# EAGLE design conductivity (EAGLE 9.2.2)
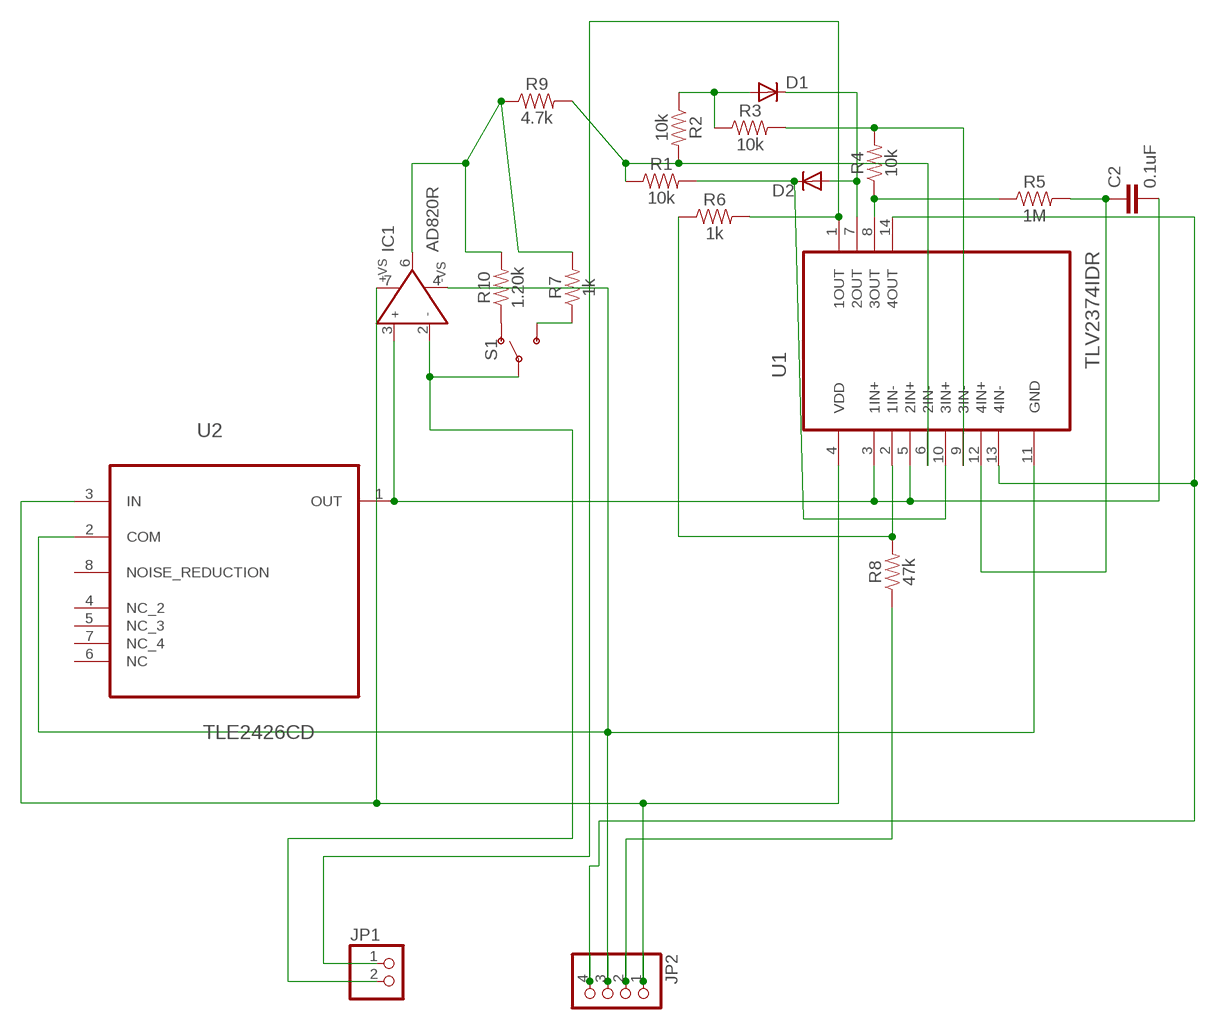
[diagram p0: schematic, sheet 1]

## Parts
C2  0.1uF  0.1UF-0603-25V-5%  [0603]
D1  DIODESOD123  [SOD123]
D2  DIODESOD123  [SOD123]
IC1  AD820R  [SO8]
JP1  PINHD-1X2  [1X02]
JP2  PINHD-1X4  [1X04]
R1  10k  10KOHM-0603-1/10W-1%  [0603]
R2  10k  10KOHM-0603-1/10W-1%  [0603]
R3  10k  10KOHM-0603-1/10W-1%  [0603]
R4  10k  10KOHM-0603-1/10W-1%  [0603]
R5  1M  1MOHM-0603-1/4W-5%  [0603]
R6  1k  1KOHM-0603-1/10W-1%  [0603]
R7  1k  1KOHM-0603-1/10W-1%  [0603]
R8  47k  47KOHM-0603-1/10W-1%  [0603]
R9  4.7k  4.7KOHM-0603-1/10W-1%  [0603]
R10  1.20k  1.20KOHM-0603-1/10W-1%  [0603]
S1  SWITCH-SPDT-SMD-AYZ0202  [SWITCH_DPDT_SMD_AYZ0202]
U1  TLV2374IDR  [SOIC127P600X175-14N]
U2  TLE2426CD  [SOIC127P600X175-8N]

## Nets
FROMWATER: IC1.2(IN-) JP1.2 S1.2(P)
N$1: IC1.7(+VS) JP2.1 U1.4(VDD) U2.3(IN)
N$2: R10.1 S1.1(O)
N$3: C2.2 IC1.3(IN+) U1.3(1IN+) U1.5(2IN+) U2.1(OUT)
N$4: R6.1 R8.2 U1.2(1IN-)
N$5: IC1.6(OUT) R7.2 R9.1 R10.2
N$6: R1.1 R2.2 R9.2 U1.6(2IN-)
N$7: D1.ANODE(A) R2.1 R3.1
N$8: D1.CATHODE(C) D2.ANODE(A) U1.7(2OUT)
N$9: D2.CATHODE(C) R1.2 U1.10(3IN+)
N$10: R3.2 R4.2 U1.9(3IN-)
N$11: R4.1 R5.1 U1.8(3OUT)
N$12: C2.1 R5.2 U1.12(4IN+)
N$13: JP2.4 U1.13(4IN-) U1.14(4OUT)
N$14: JP2.2 R8.1
N$15: IC1.4(-VS) JP2.3 U1.11(GND) U2.2(COM)
N$16: JP1.1 R6.2 U1.1(1OUT)
N$17: R7.1 S1.3(S)
Unconnected: U2.4(NC_2) U2.5(NC_3) U2.6(NC) U2.7(NC_4) U2.8(NOISE_REDUCTION)

## Library data of the parts
C2 = SparkFun-Capacitors:0.1UF: 0.1µF ceramic capacitors A capacitor is a passive two-terminal electrical component used to store electrical energy temporarily in an electric field.; PROD_ID: CAP-08604
D1 D2 = trellisLaura:DIODE: DIODE high speed (Philips)
IC1 = AD820:AD820: Single-Supply, Rail-to-Rail, Low Power, FET Input Op Amp Source: http://www.analog.com/static/imported-files/data_sheets/AD820.pdf; AVAILABILITY: Unavailable; MF: Analog Devices; MP: AD820; PACKAGE: None; PRICE: None
JP1 = pinhead:PINHD-1X2: PIN HEADER
JP2 = pinhead:PINHD-1X4: PIN HEADER
R1-R4 = SparkFun-Resistors:10KOHM: 10kΩ resistor A resistor is a passive two-terminal electrical component that implements electrical resistance as a circuit element. Resistors act to reduce current flow, and, at the same time, act to lower voltage levels within circuits. - Wikipedia; PROD_ID: RES-00824
R5 = SparkFun-Resistors:1MOHM: 1MΩ resistor A resistor is a passive two-terminal electrical component that implements electrical resistance as a circuit element. Resistors act to reduce current flow, and, at the same time, act to lower voltage levels within circuits. - Wikipedia; PROD_ID: RES-07868
R6 R7 = SparkFun-Resistors:1KOHM: 1kΩ resistor A resistor is a passive two-terminal electrical component that implements electrical resistance as a circuit element. Resistors act to reduce current flow, and, at the same time, act to lower voltage levels within circuits. - Wikipedia; PROD_ID: RES-07856
R8 = SparkFun-Resistors:47KOHM: 47kΩ resistor A resistor is a passive two-terminal electrical component that implements electrical resistance as a circuit element. Resistors act to reduce current flow, and, at the same time, act to lower voltage levels within circuits. - Wikipedia; PROD_ID: RES-07871
R9 = SparkFun-Resistors:4.7KOHM: 4.7kΩ resistor A resistor is a passive two-terminal electrical component that implements electrical resistance as a circuit element. Resistors act to reduce current flow, and, at the same time, act to lower voltage levels within circuits. - Wikipedia; PROD_ID: RES-07857
R10 = SparkFun-Resistors:1.20KOHM: 1.20kΩ resistor A resistor is a passive two-terminal electrical component that implements electrical resistance as a circuit element. Resistors act to reduce current flow, and, at the same time, act to lower voltage levels within circuits. - Wikipedia; PROD_ID: RES-08413
S1 = SparkFun-Switches:SWITCH-SPDT: Single Pole, Double Throw (SPDT) Switch Single-pole, double-throw (SPDT) switch. Variant Overview SMD-AYZ0202 Surface Mount DPDT Switch <https://www.sparkfun.com/products/597> (COM-00597) Used on e.g. LilyPad Arduino USB - ATmega32U4 Board <https://www.sparkfun.com/products/12049> PTH-11.6X4.0MM SPDT Mini Power Switch <https://www.sparkfun.com/products/102> (COM-00102) Used on e.g. SparkFun Simon Says - Through-Hole Soldering Kit <https://www.sparkfun.com/products/10547> (KIT-10547) PTH-11.6X4.0MM-KIT KIT version of SPDT Mini Power Switch - Simplifies soldering by removing tStop of switch pins - only one side can be soldered. PTH-11.6X4.0MM-LOCK LOCK version of SPDT Mini Power Switch - Offset pins hold switch in place for easier soldering. SMD-RIGHT-ANGLE Surface Mount Right Angle Switch <https://www.sparkfun.com/products/10860> (COM-10860) Used on e.g. SparkFun ESP8266 Thing <https://www.sparkfun.com/products/13231>; PROD_ID: SWCH-08179; SF_ID: COM-00597
U1 = TLV2374IDR:TLV2374IDR: OPERATIONAL AMPLIFIERS; AVAILABILITY: Good; DESCRIPTION: 550-uA/Channel 3-MHz RRIO Op Amp 14-SOIC -40 to 125; MF: Texas Instruments; MP: TLV2374IDR; PACKAGE: SOIC-14 Texas Instruments; PRICE: 1.13 USD
U2 = TLE2426CD:TLE2426CD: PRECISION VIRTUAL GROUND; AVAILABILITY: Good; DESCRIPTION: Voltage Reference Adjustable 2 Volt TO 20 Volt 20 mA 8-Pin SOIC Tube; MF: Texas Instruments; MP: TLE2426CD; PACKAGE: SOIC-8 Texas Instruments; PRICE: 1.16 USD

## Net classes
0 default: width 0.305 mm, drill 0.508 mm, clearance 0.254 mm

## Board
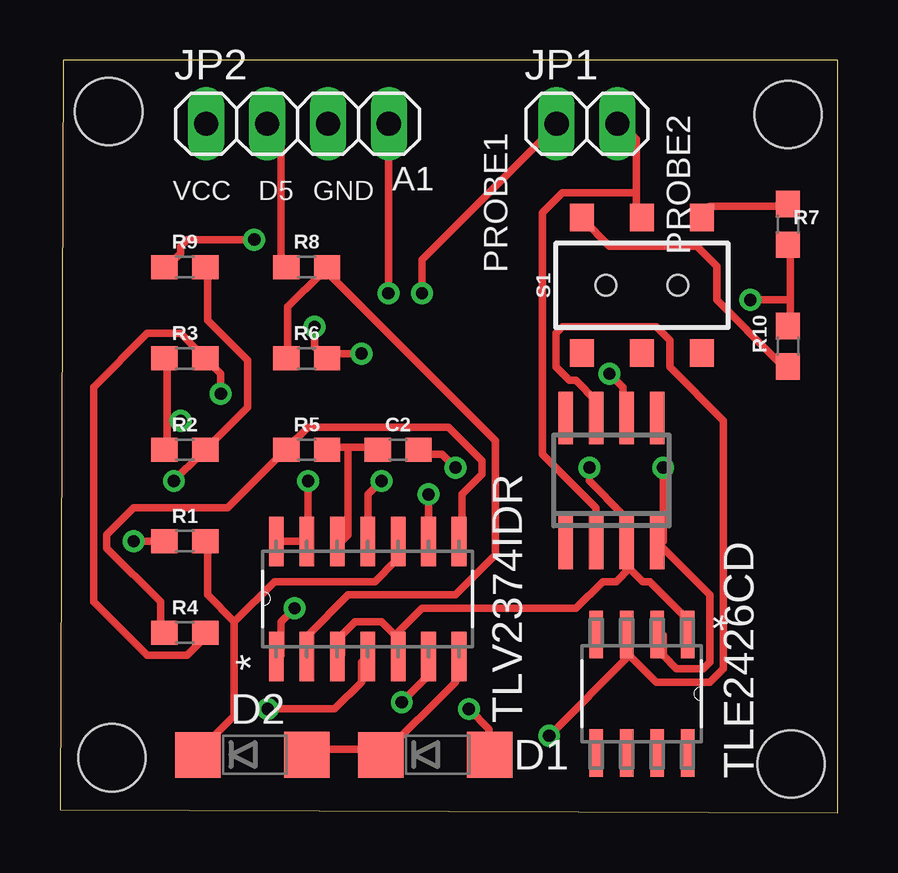
[diagram p1: board, top side]
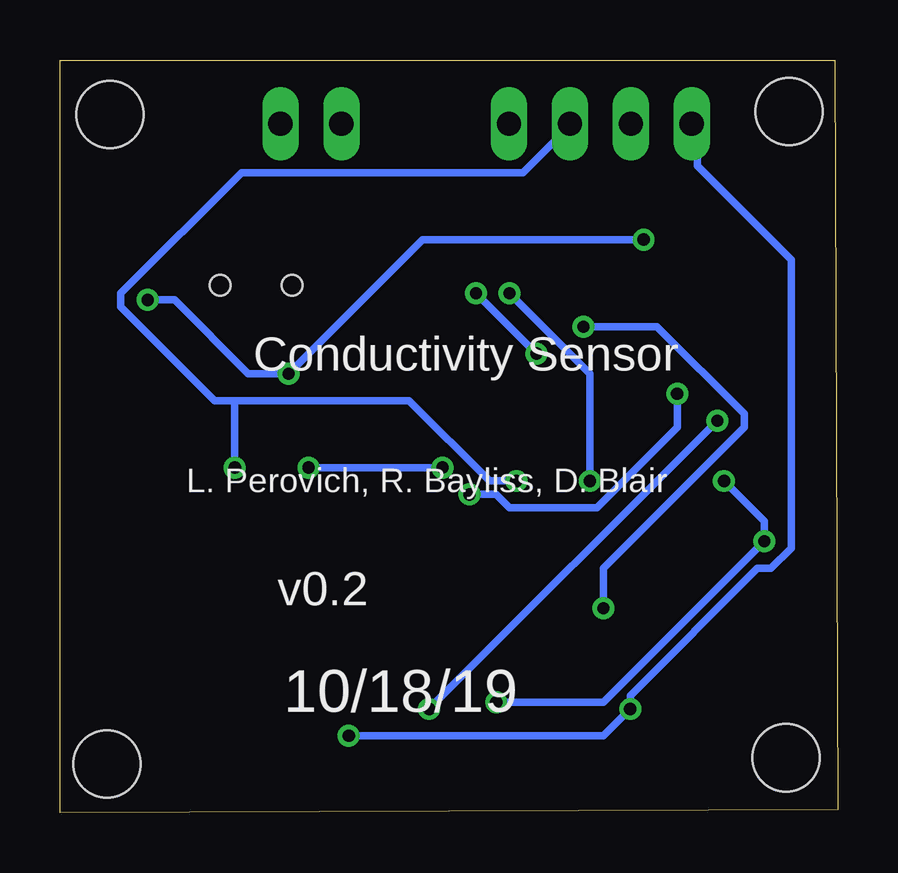
[diagram p2: board, bottom side, seen from below]

Size 32.44 x 31.36 mm. Coordinates in mm from the lower left corner, seen from the top.
Outline: 0,0.13 32.44,0 32.44,31.36 0.13,31.36 0,0.13
Copper layers (1*16): Top 0.035mm / dielectric 1.5mm / Bottom 0.035mm
Design rules "default": minimum track width 6mil, minimum drill 0.35mm, track to track 6mil, track to pad 6mil, pad to pad 6mil, via to via 6mil, smd to smd 6mil, copper to edge 40mil, drill to drill 6mil, minimum pad ring 10mil, minimum via ring 8mil, stop-mask expansion 4mil, vias tented up to drill 0mil, thermal gap 10mil
Holes 2.8 mm at 2.03,29.21 30.35,29.08 30.48,2.03 2.16,2.29

### Footprints (pad centres in the part's own frame; a part is rotated, then mirrored left to right if it is on the bottom)
0603 = smd 1.1 x 1: 1 -0.85,0; 2 0.85,0
SOD123 = smd 1.905 x 1.905: ANODE 2.165,0; CATHODE -2.375,-0.014
SO8 = smd 0.6 x 2.2: 1 -1.905,-2.6; 2 -0.635,-2.6; 3 0.635,-2.6; 4 1.905,-2.6; 5 1.905,2.6; 6 0.635,2.6; 7 -0.635,2.6; 8 -1.905,2.6
1X02 = drill 1.016 long: 1 -1.27,0; 2 1.27,0
1X04 = drill 1.016 long: 1 -3.81,0; 2 -1.27,0; 3 1.27,0; 4 3.81,0
SWITCH_DPDT_SMD_AYZ0202 = smd 1 x 1.15: 1 -2.5,2.825; 2 0,2.825; 3 2.5,2.825; 4 -2.5,-2.825; 5 0,-2.825; 6 2.5,-2.825 | hole 0.85: 1.5,0; -1.5,0
SOIC127P600X175-14N = smd 2.057 x 0.61: 1 -4.801,7.62; 2 -4.801,6.35; 3 -4.801,5.08; 4 -4.801,3.81; 5 -4.801,2.54; 6 -4.801,1.27; 7 -4.801,0; 8 0,0; 9 0,1.27; 10 0,2.54; 11 0,3.81; 12 0,5.08; 13 0,6.35; 14 0,7.62
SOIC127P600X175-8N = smd 1.981 x 0.559: 1 -2.464,1.905; 2 -2.464,0.635; 3 -2.464,-0.635; 4 -2.464,-1.905; 5 2.464,-1.905; 6 2.464,-0.635; 7 2.464,0.635; 8 2.464,1.905

### Placement (x,y rotation side)
C2  14.1,15.11 0 top
D1  15.75,2.41 0 top
D2  8.13,2.41 0 top
IC1  22.99,13.84 0 top
JP1  21.97,28.7 0 top
JP2  9.91,28.7 0 top
R1  5.21,11.3 0 top
R2  5.21,15.11 0 top
R3  5.21,18.92 0 top
R4  5.21,7.49 0 top
R5  10.29,15.11 0 top
R6  10.29,18.92 0 top
R7  30.35,24.51 270 top
R8  10.29,22.73 0 top
R9  5.21,22.73 0 top
R10  30.35,19.43 90 top
S1  24.26,21.97 0 top
U1  16.64,11.3 90 top
U2  24.26,4.95 270 top

### Tracks (layer width: path | path; a pad name or v marks a point on that pad's centre or on a via)
FROMWATER
  Top 0.305: 24.03,25.83 24.03,28.07 23.47,28.63 JP1.2 | 24.03,25.83 24.03,24.99 S1.2 | IC1.2 22.35,12.7 20.12,14.94 20.12,24.99 20.95,25.83 24.03,25.83
N$1  (via drill 0.51)
  Top 0.305: 23.75,6.55 23.75,7.39 U2.3 23.75,6.55 | 23.75,6.55 24.87,5.44 27.1,5.44 27.66,5.99 27.66,16.33 25.43,18.57 25.43,19.68 24.87,20.24 20.95,20.24 20.68,19.96 20.68,18.57 21.23,18.01 21.51,18.01 22.35,17.17 IC1.7 | v8.66,4.32 11.46,4.32 12.57,5.44 12.57,6.27 U1.4 | v20.4,3.2 23.75,6.55
  Bottom 0.305: JP2.1 5.87,28.63 5.87,26.95 1.96,23.04 1.96,11.02 2.79,10.19 3.35,10.19 8.66,4.88 v8.66,4.32 9.78,3.2 v20.4,3.2
N$2
  Top 0.305: R10.1 30.18,18.85 29.9,18.85 27.38,21.36 27.38,22.76 26.54,23.6 22.91,23.6 21.79,24.71 S1.1
N$3  (via drill 0.51)
  Top 0.305: 13.97,7.39 13.41,7.95 12.29,7.95 11.73,7.39 11.73,6.55 U1.3 | 13.97,7.39 13.97,6.55 U1.5 13.97,7.39 | v16.48,14.38 15.93,14.94 15.09,14.94 C2.2 | v22.07,14.38 22.07,13.82 23.47,12.42 23.47,11.3 IC1.3 | 23.75,10.19 24.31,9.63 24.59,9.63 25.98,8.23 25.98,7.67 U2.1 | 23.75,10.19 23.75,11.02 IC1.3 | 13.97,7.39 15.09,8.51 21.51,8.51 22.63,9.63 23.19,9.63 23.75,10.19 | 23.75,10.19 IC1.3
  Bottom 0.305: v22.07,14.38 v16.48,14.38
N$4
  Top 0.305: R6.1 9.5,19.13 9.5,21.08 10.9,22.48 R8.2 11.18,22.48 18.16,15.49 18.16,10.74 16.48,9.07 12.01,9.07 10.34,7.39 10.34,6.55 U1.2
N$5  (via drill 0.51)
  Top 0.305: 30.45,21.36 30.45,23.6 R7.2 | 30.45,21.36 30.45,20.52 R10.2 | v8.1,23.88 5.31,23.88 5.03,23.6 5.03,23.32 4.47,22.76 R9.1 | v22.91,18.29 23.47,17.73 23.47,16.61 IC1.6 | v28.78,21.36 30.45,21.36
  Bottom 0.305: v8.1,23.88 17.32,23.88 v22.91,18.29 24.59,18.29 27.66,21.36 v28.78,21.36
N$6  (via drill 0.51)
  Top 0.305: v3.07,11.3 R1.1 | v4.75,13.82 5.87,14.94 R2.2 6.15,15.21 7.82,16.89 7.82,18.85 6.15,20.52 6.15,22.48 R9.2 | U1.6 15.37,5.71 v14.25,4.6
  Bottom 0.305: v4.75,13.82 3.07,12.14 v3.07,11.3 9.78,4.6 v14.25,4.6
N$7  (via drill 0.51)
  Top 0.305: 4.47,16.33 4.47,18.85 R3.1 | 4.47,16.33 4.47,15.21 R2.1 | v17.04,4.32 17.88,3.48 17.88,2.64 D1.ANODE | 4.47,16.33 v5.03,16.33
  Bottom 0.305: v5.03,16.33 v17.04,4.32
N$8
  Top 0.305: D2.ANODE 10.34,2.64 13.13,2.64 D1.CATHODE 13.41,2.36 16.48,5.44 16.48,6.27 U1.7
N$9
  Top 0.305: 7.26,7.95 6.15,9.07 6.15,11.3 R1.2 | 7.26,7.95 7.26,4.04 5.87,2.64 D2.CATHODE | 7.26,7.95 8.94,9.63 13.13,9.63 13.97,10.46 13.97,11.3 U1.10
N$10  (via drill 0.51)
  Top 0.305: R4.2 5.87,7.39 5.87,7.11 5.31,6.55 3.63,6.55 1.4,8.79 1.4,17.73 3.63,19.96 5.03,19.96 5.87,19.13 R3.2 6.15,18.85 6.71,18.29 v6.71,17.45 | v15.37,13.26 U1.9
  Bottom 0.305: v15.37,13.26 14.25,13.26 13.69,12.7 10.06,12.7 6.71,16.05 v6.71,17.45
N$11
  Top 0.305: R4.1 4.19,7.67 4.19,8.79 1.96,11.02 1.96,11.58 3.07,12.7 6.99,12.7 9.22,14.94 R5.1 9.5,15.21 10.34,16.05 16.2,16.05 17.6,14.66 17.6,14.1 16.76,13.26 16.76,11.3 U1.8
N$12
  Top 0.305: 12.01,15.21 13.13,15.21 C2.1 | 12.01,15.21 11.18,15.21 R5.2 | 12.01,15.21 12.01,11.58 11.73,11.3 U1.12
N$13  (via drill 0.51)
  Top 0.305: U1.14 U1.13 10.34,11.3 v10.34,13.82 | v13.69,21.64 13.69,28.63 JP2.4
  Bottom 0.305: v10.34,13.82 10.34,18.29 v13.69,21.64
N$14
  Top 0.305: R8.1 9.22,22.76 9.22,28.07 8.66,28.63 JP2.2
N$15  (via drill 0.51)
  Top 0.305: U2.2 25.15,7.39 25.15,6.55 25.7,5.99 26.82,5.99 27.1,6.27 27.1,9.07 25.15,11.02 IC1.4 25.15,11.3 v25.15,14.38 | v13.41,13.82 12.85,13.26 12.85,11.3 U1.11
  Bottom 0.305: v13.41,13.82 14.53,13.82 17.88,17.17 25.15,17.17 | 25.15,17.17 25.98,17.17 29.9,21.08 29.9,21.64 24.87,26.67 13.13,26.67 11.18,28.63 JP2.3 | 25.15,17.17 v25.15,14.38
N$16  (via drill 0.51)
  Top 0.305: v12.57,19.13 11.18,19.13 R6.2 10.9,19.13 10.62,19.41 v10.62,20.24 | v15.09,21.64 15.09,23.04 20.68,28.63 JP1.1 | v9.78,8.51 9.22,7.95 9.22,6.55 U1.1
  Bottom 0.305: v15.09,21.64 v12.57,19.13 | v9.78,8.51 9.78,10.19 3.91,16.05 3.91,16.61 7.54,20.24 v10.62,20.24
N$17
  Top 0.305: R7.1 30.18,25.27 27.1,25.27 26.82,24.99 S1.3

### Text on the board
tNames: PROBE2 | PROBE1 | A1 | VCC | D5 | GND
bNames: Conductivity Sensor | L. Perovich, R. Bayliss, D. Blair | v0.2 | 10/18/19